# EAGLE design BPF_eval_R3 (EAGLE 8.5.0)
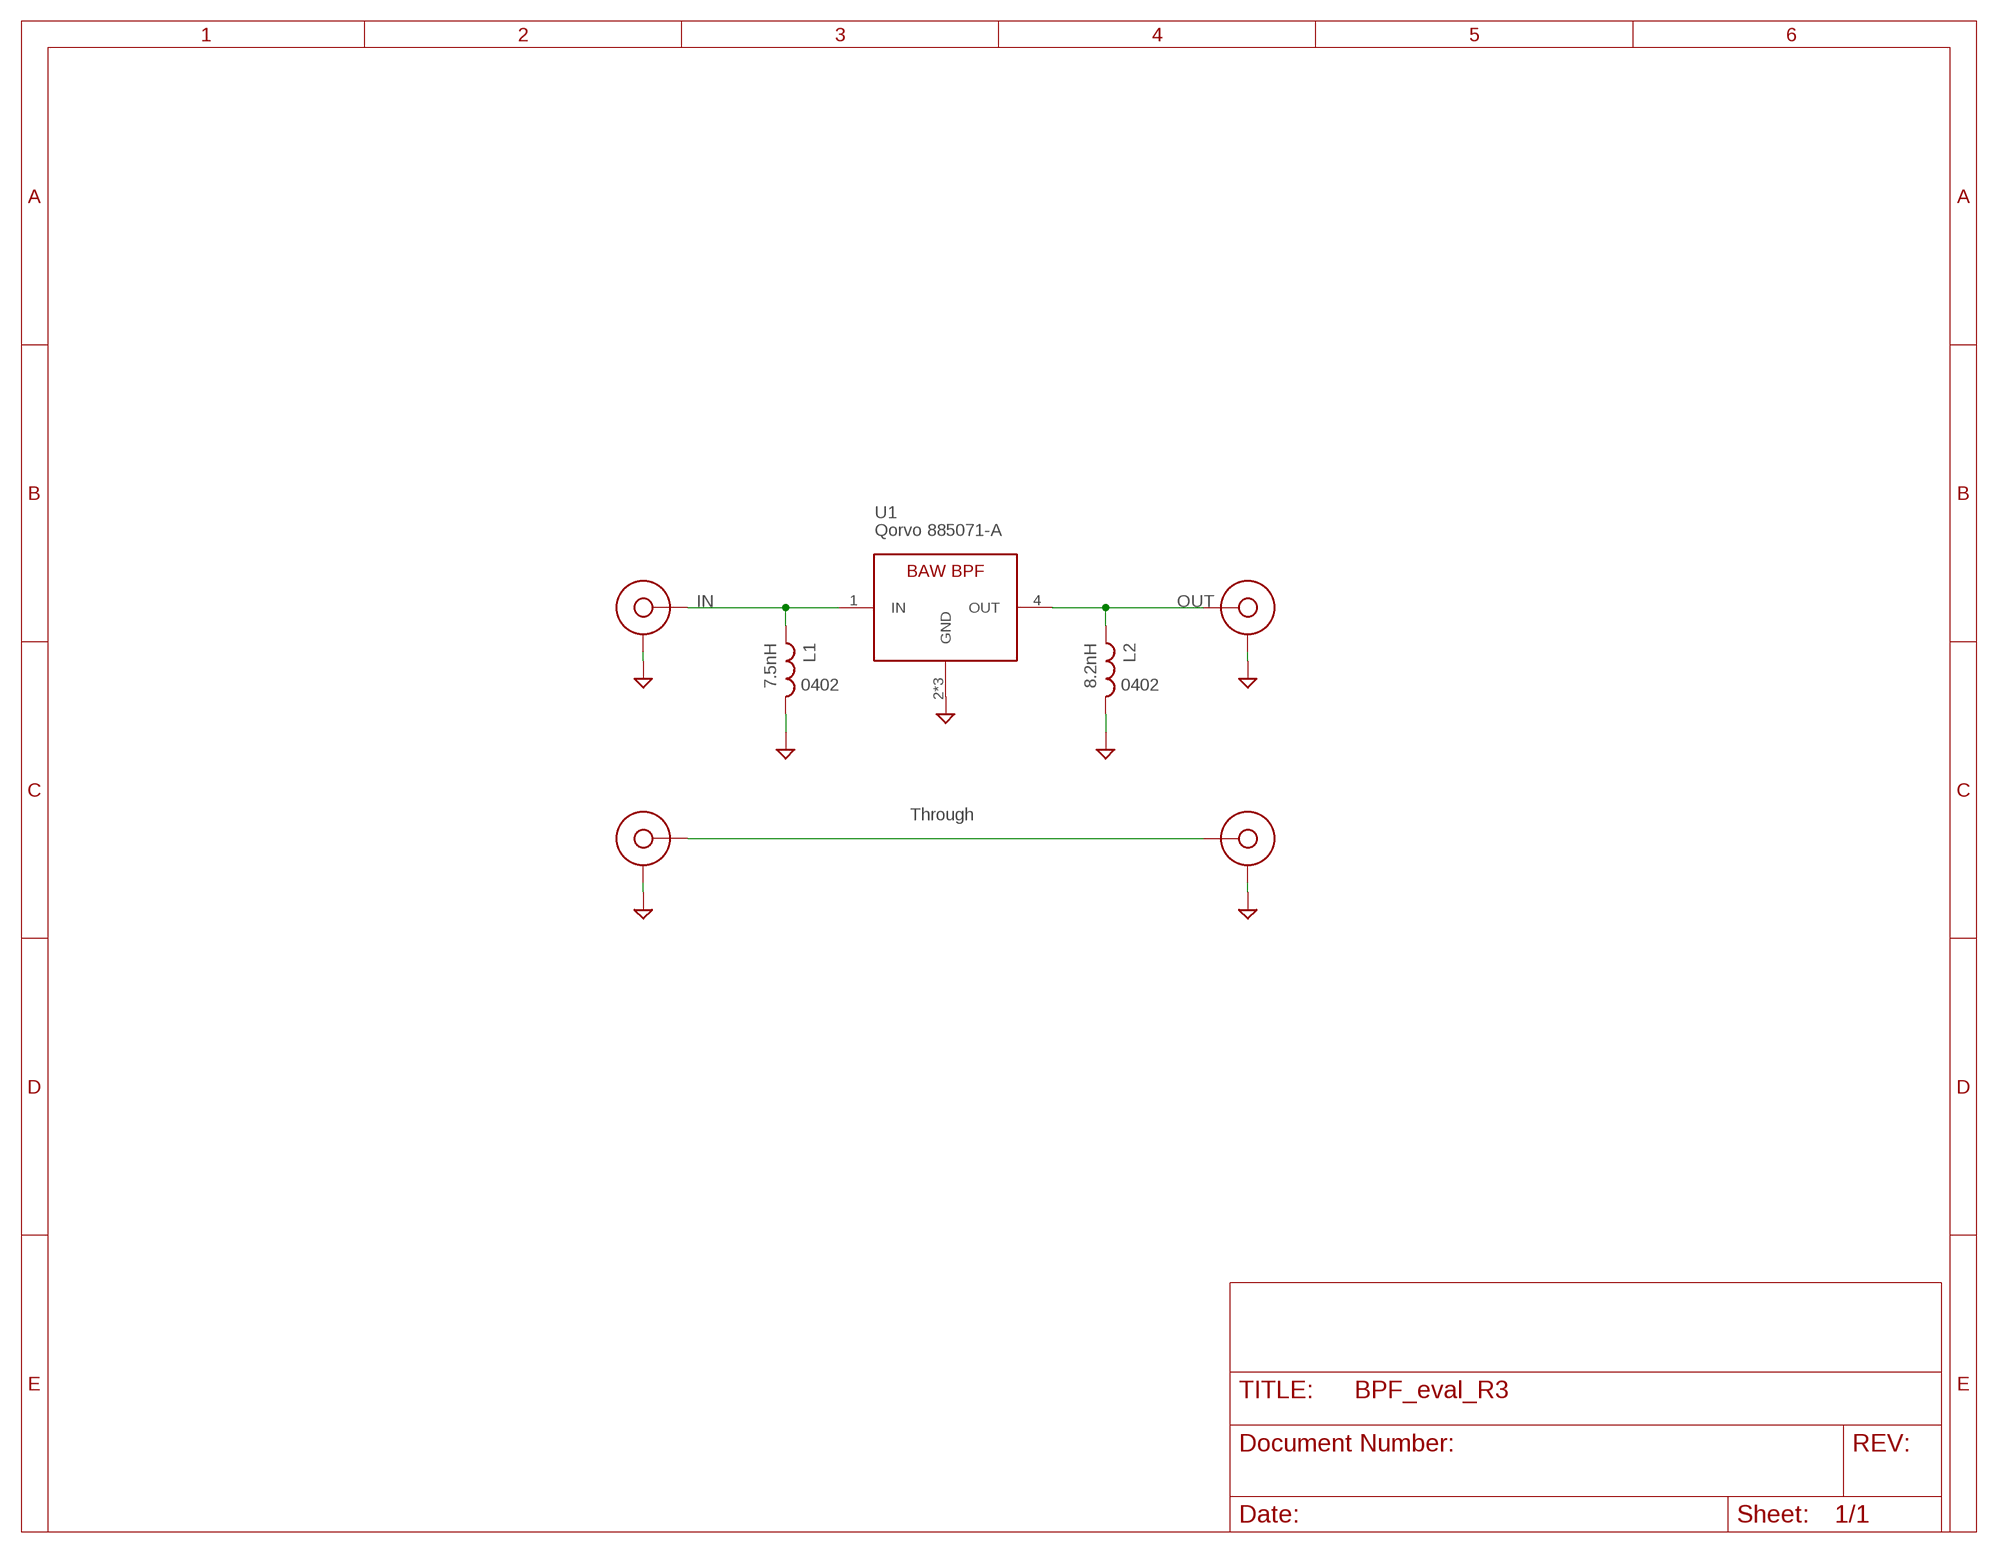
[diagram p0: schematic, sheet 1]

## Parts
CF1  SMA-CINCH-END-FIRE  [SMAJ716-ND]
CF2  SMA-CINCH-END-FIRE  [SMAJ716-ND]
CF3  SMA-CINCH-END-FIRE  [SMAJ716-ND]
CF4  SMA-CINCH-END-FIRE  [SMAJ716-ND]
L1  7.5nH  L-US0402-B-NOSILK  [.0402-B-NOSILK]
L2  8.2nH  L-US0402-B-NOSILK  [.0402-B-NOSILK]
U1  885071-A  [FIL_B39162B9417K610]

## Nets
GND: CF1.GND1(GND) CF1.GND2(GND) CF1.GND3(GND) CF1.GND4(GND) CF2.GND1(GND) CF2.GND2(GND) CF2.GND3(GND) CF2.GND4(GND) CF3.GND1(GND) CF3.GND2(GND) CF3.GND3(GND) CF3.GND4(GND) CF4.GND1(GND) CF4.GND2(GND) CF4.GND3(GND) CF4.GND4(GND) L1.2 L2.2 U1.2(GND) U1.3(GND) U1.5(GND)
IN [RF]: CF1.P$3(CENTERCONDUCTOR) L1.1 U1.1(IN)
OUT [RF]: CF3.P$3(CENTERCONDUCTOR) L2.1 U1.4(OUT)
THROUGH [RF]: CF2.P$3(CENTERCONDUCTOR) CF4.P$3(CENTERCONDUCTOR)

## Notes on the sheet
- Qorvo 885071-A
- 0402 | 0402
- Through

## Library data of the parts
CF1-CF4 = psas_c3_team05:SMA-CINCH-END-FIRE
L1 L2 = rcl_custom:L-US: INDUCTOR, American symbol
U1 = 885071_A:885071-A: 2.4GHz BPF

## Net classes
1 RF: width 0.33 mm, clearance 0.34 mm

## Board
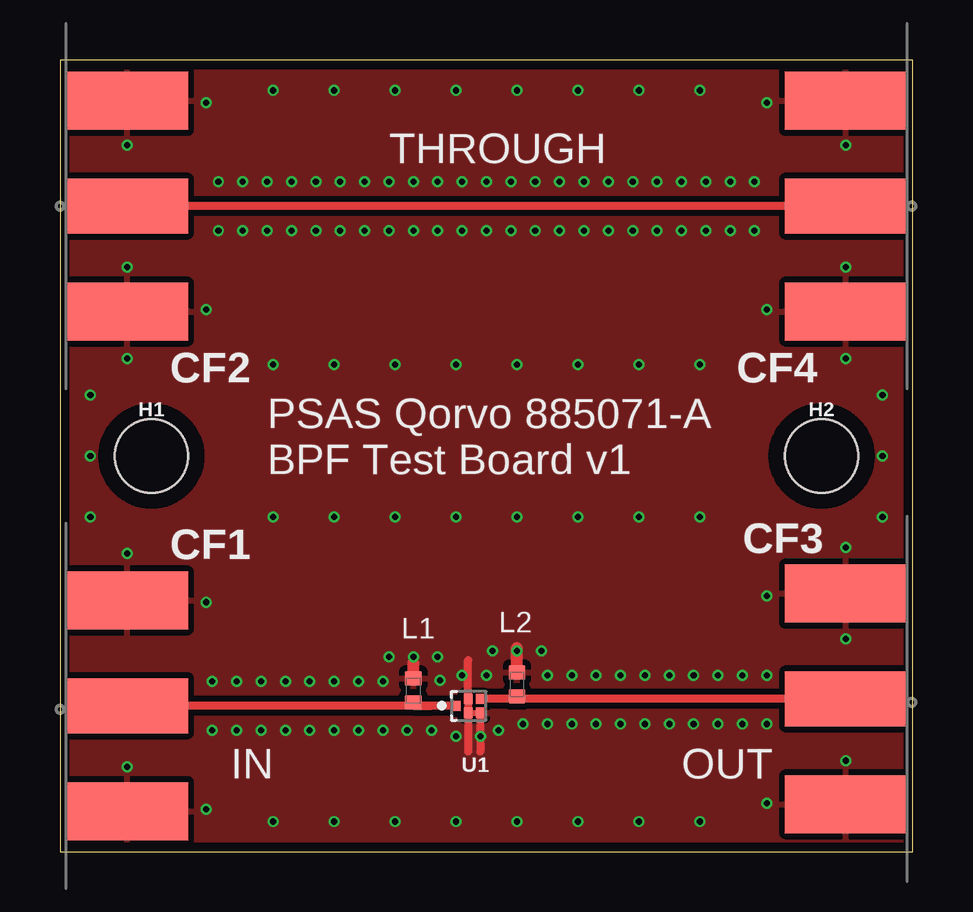
[diagram p1: board, top side]
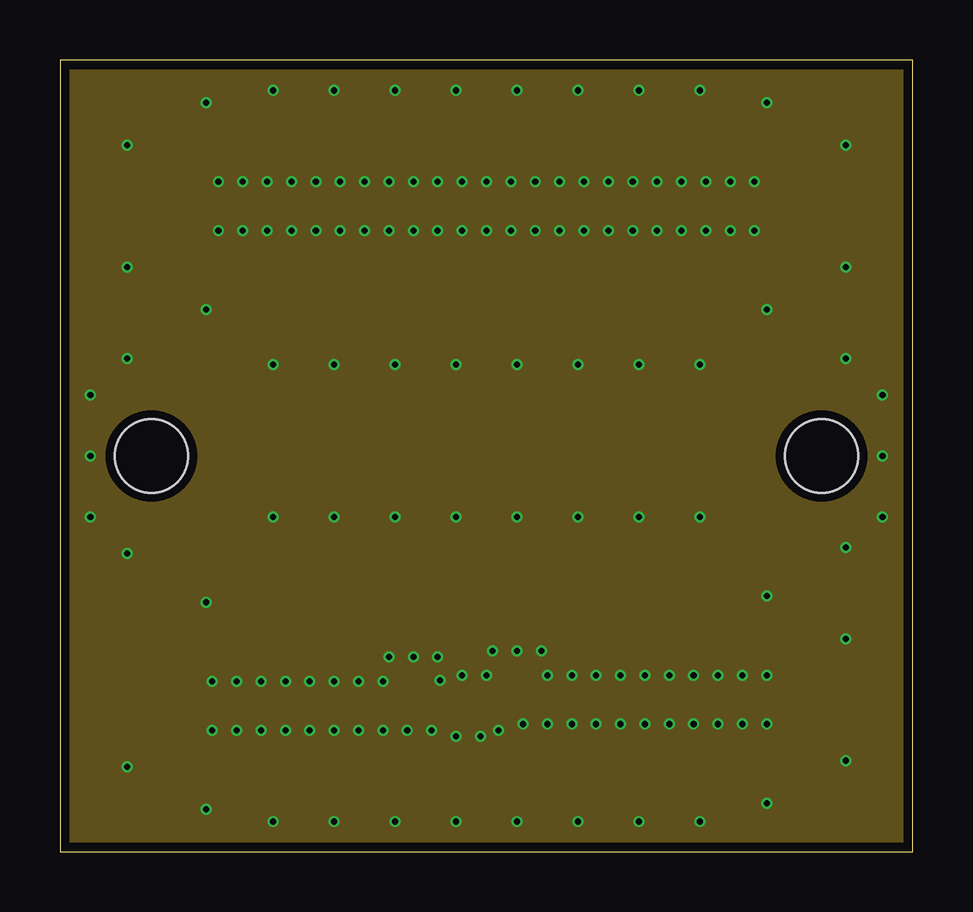
[diagram p2: board, inner layer Route2]
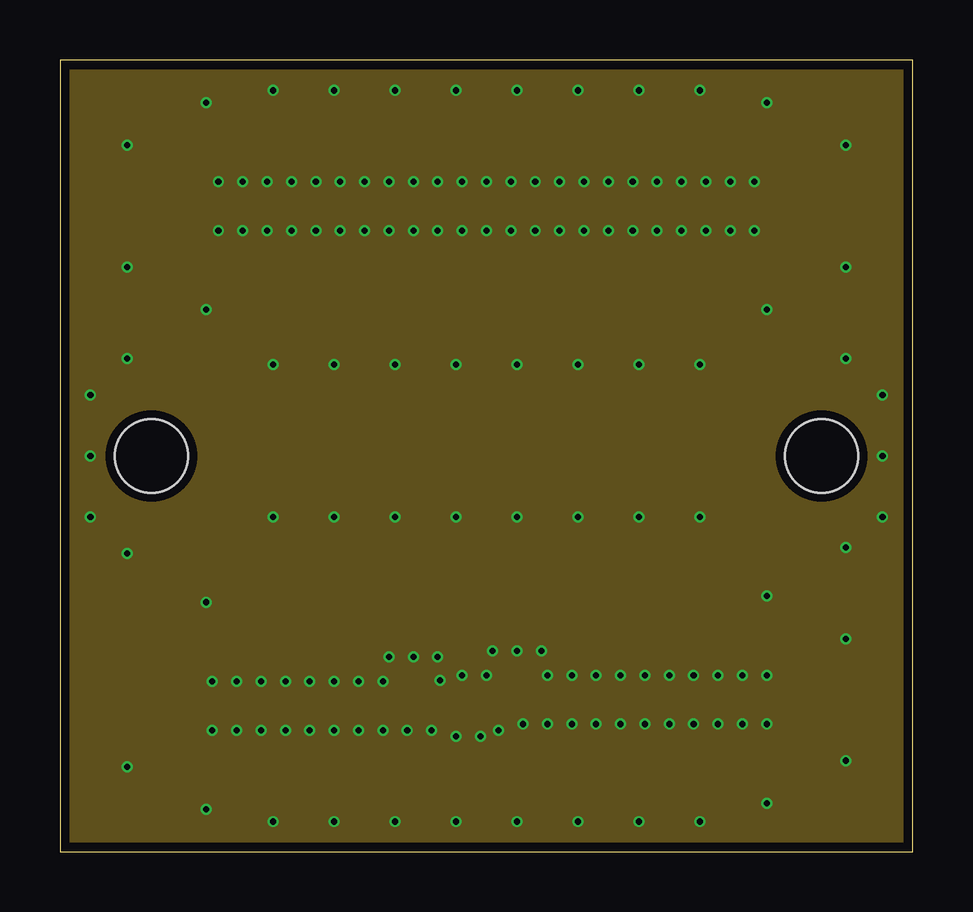
[diagram p3: board, inner layer Route15]
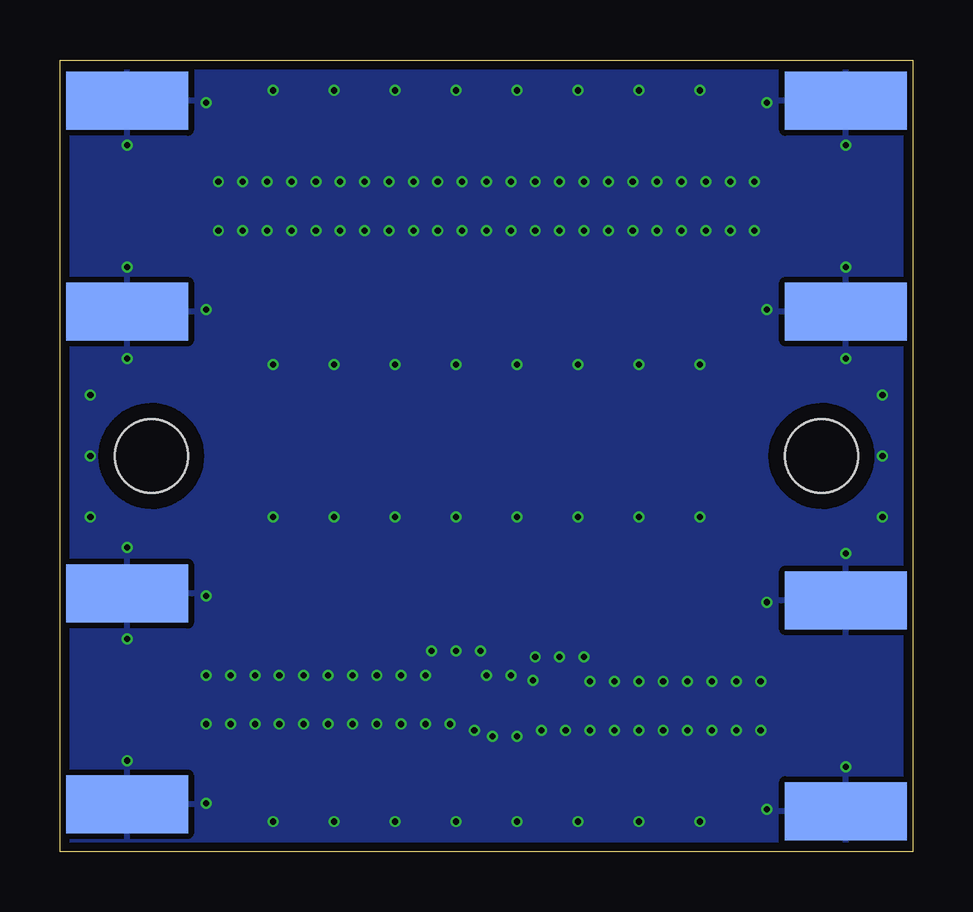
[diagram p4: board, bottom side, seen from below]

Size 35.56 x 33.02 mm. Coordinates in mm from the lower left corner, seen from the top.
Outline: 0,0 35.56,0 35.56,33.02 0,33.02 0,0
Copper layers (1*2*15*16): Top 0.035559375mm / dielectric 0.17018125mm / Route2 0.01778125mm / dielectric 47mil / Route15 0.01778125mm / dielectric 0.17018125mm / Bottom 0.035559375mm
Design rules "oshpark-4layer": minimum track width 5mil, minimum drill 10mil, track to track 5mil, track to pad 5mil, pad to pad 5mil, via to via 5mil, smd to smd 5mil, copper to edge 15mil, drill to drill 6mil, minimum pad ring 4mil, minimum via ring 4mil, stop-mask expansion 2.5mil, vias tented up to drill 0mil, thermal gap 10mil

### Footprints (pad centres in the part's own frame; a part is rotated, then mirrored left to right if it is on the bottom)
SMAJ716-ND = smd 2.413 x 5.08 bottom: GND1 4.394,0; GND3 -4.394,0 | smd 2.413 x 5.08: GND2 -4.394,0; GND4 4.394,0 | smd 2.286 x 5.08: P$3 0,0
STAND-OFF-TIGHT = hole 3.048: 0,0
.0402-B-NOSILK = smd 0.6 x 0.7: 1 -0.5,0; 2 0.5,0
FIL_B39162B9417K610 = smd 0.35 x 0.425: 1 -0.5,0; 2 0,-0.287; 3 0.5,-0.287; 4 0.5,0.287; 5 0,0.287

### Placement (x,y rotation side)
CF1  2.79,6.1 90 top
CF2  2.79,26.92 90 top
CF3  32.77,6.38 270 top
CF4  32.77,26.92 270 top
H1  STAND-OFFTIGHT  [STAND-OFF-TIGHT]  3.81,16.51 0 top
H2  STAND-OFFTIGHT  [STAND-OFF-TIGHT]  31.75,16.51 0 top
L1  14.73,6.73 90 top
L2  19.05,6.99 90 top
U1  17.02,6.1 0 top

### Tracks (layer width: path | path; a pad name or v marks a point on that pad's centre or on a via)
GND  (via drill 0.25)
  Top 0.254: U1.2 U1.3
  Top 0.33: U1.3 17.52,4.96 17.53,4.19 | 17.02,4.19 U1.2 U1.5 17.02,8
  Top 0.508: L1.2 14.73,7.87 | L2.2 19.05,8.51
  other vias: 6.1,31.24 6.6,27.94 7.62,27.94 8.64,27.94 9.65,27.94 10.67,27.94 11.68,27.94 12.7,27.94 13.72,27.94 14.73,27.94 15.75,27.94 16.76,27.94 17.78,27.94 18.8,27.94 19.81,27.94 20.83,27.94 21.84,27.94 22.86,27.94 23.88,27.94 24.89,27.94 25.91,27.94 26.92,27.94 27.94,27.94 28.96,27.94 6.6,25.91 7.62,25.91 8.64,25.91 9.65,25.91 10.67,25.91 11.68,25.91 12.7,25.91 13.72,25.91 14.73,25.91 15.75,25.91 16.76,25.91 17.78,25.91 18.8,25.91 19.81,25.91 20.83,25.91 21.84,25.91 22.86,25.91 23.88,25.91 24.89,25.91 25.91,25.91 26.92,25.91 27.94,25.91 28.96,25.91 6.35,7.11 7.37,7.11 8.38,7.11 9.4,7.11 10.41,7.11 11.43,7.11 12.45,7.11 13.46,7.11 14.73,8.13 15.85,7.16 17.78,7.37 18.03,8.38 20.07,8.38 20.32,7.37 21.34,7.37 22.35,7.37 23.37,7.37 24.38,7.37 25.4,7.37 26.42,7.37 27.43,7.37 28.45,7.37 29.46,7.37 6.35,5.08 7.37,5.08 8.38,5.08 9.4,5.08 10.41,5.08 11.43,5.08 12.45,5.08 13.46,5.08 14.48,5.08 15.49,5.08 16.51,4.83 18.29,5.08 19.3,5.33 20.32,5.33 21.34,5.33 22.35,5.33 23.37,5.33 24.38,5.33 25.4,5.33 26.42,5.33 27.43,5.33 28.45,5.33 29.46,5.33 2.79,3.56 6.1,1.78 2.79,12.45 6.1,10.41 32.77,3.81 32.77,8.89 29.46,10.67 32.77,12.7 29.46,2.03 32.77,29.46 32.77,24.38 29.46,22.61 32.77,20.57 29.46,31.24 6.1,22.61 2.79,20.57 2.79,24.38 2.79,29.46 1.27,13.97 1.27,16.51 1.27,19.05 8.89,31.75 11.43,31.75 13.97,31.75 16.51,31.75 19.05,31.75 21.59,31.75 24.13,31.75 26.67,31.75 34.29,19.05 34.29,16.51 34.29,13.97 8.89,1.27 11.43,1.27 13.97,1.27 16.51,1.27 19.05,1.27 21.59,1.27 24.13,1.27 26.67,1.27 8.89,13.97 11.43,13.97 13.97,13.97 16.51,13.97 19.05,13.97 21.59,13.97 24.13,13.97 26.67,13.97 8.89,20.32 11.43,20.32 13.97,20.32 16.51,20.32 19.05,20.32 21.59,20.32 24.13,20.32 26.67,20.32 15.75,8.13 13.72,8.13 19.05,8.38 16.76,7.37 17.53,4.83
  pour Top (isolate 0.254): 0,0 35.56,0 35.56,33.02 0,33.02
  pour Route2 (isolate 0.254): 0,33.02 0.15,0.15 35.36,0.15 35.56,33.02
  pour Route15: 0,33.02 35.56,33.02 35.56,0 0,0
  pour Bottom (isolate 0.254): 0,33.02 35.56,33.02 35.56,0 0,0
IN
  Top 0.33: 15.49,6.1 CF1.P$3 | U1.1 15.49,6.1 | L1.1 14.73,6.1 15.49,6.1
  Top 1.092: 2.37,5.94 CF1.P$3
OUT
  Top 0.33: CF3.P$3 19.05,6.38 | 19.05,6.38 U1.4 | L2.1 19.05,6.38
THROUGH
  Top 0.33: CF4.P$3 CF2.P$3

### Text on the board
tPlace: THROUGH | PSAS Qorvo 885071-A / BPF Test Board v1 | IN | OUT